# Altium schematic sheet PCB1.SchDoc
size A
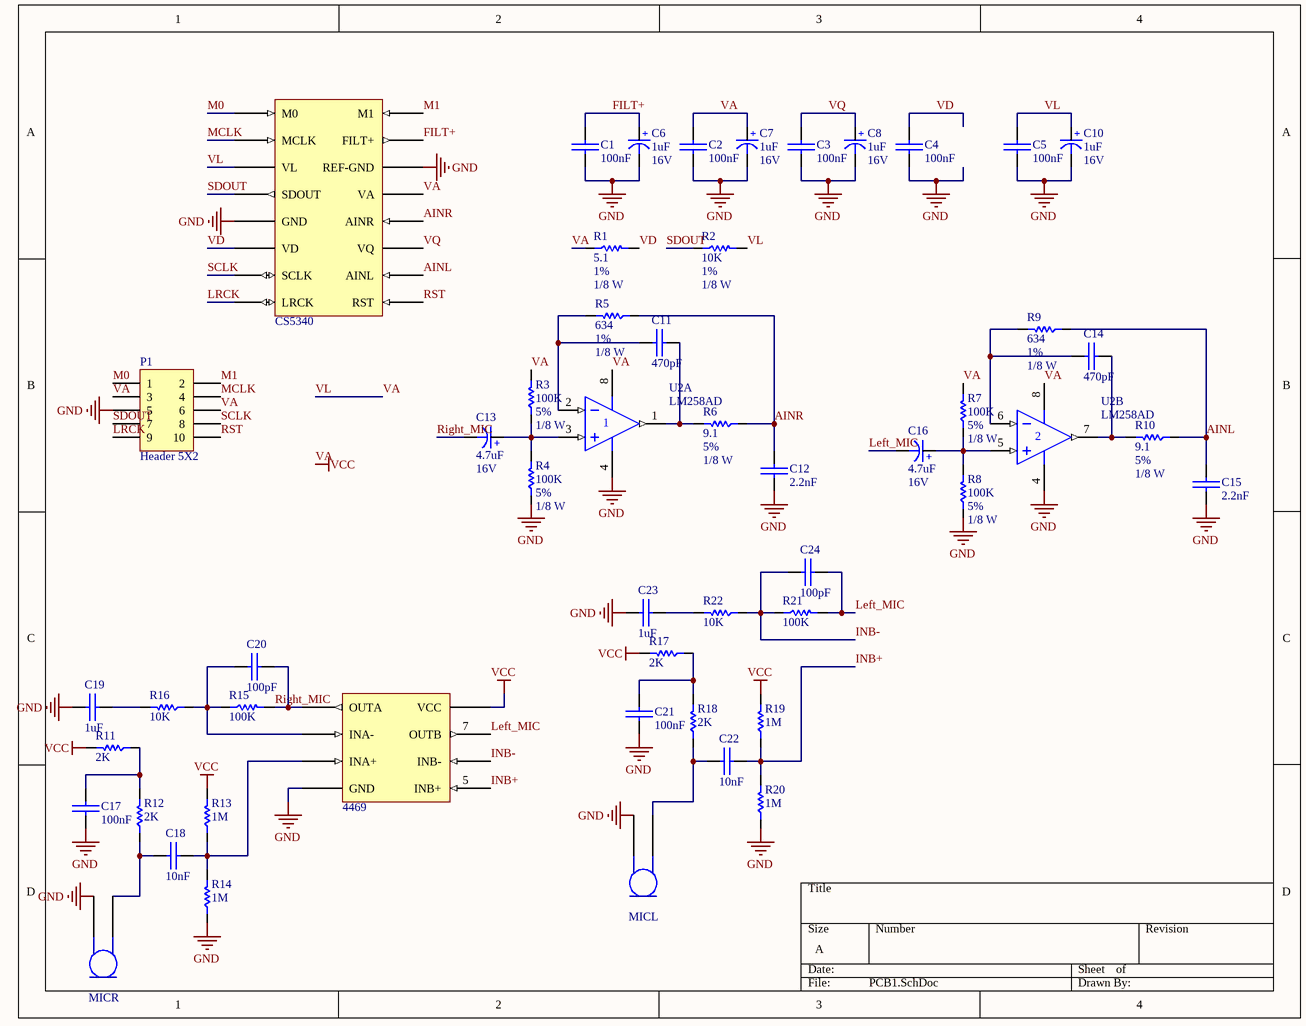
[diagram p0: PCB1.SchDoc]

## Parts
4469  MAX4469EKA+T  [SOT23-8_L]  (value not drawn)
C1  100nF  [SMD_CAP_1206]
C2  100nF  [SMD_CAP_1206]
C3  100nF  [SMD_CAP_1206]
C4  100nF  [SMD_CAP_1206]
C5  100nF  [SMD_CAP_1206]
C6  Voltage: 16V  [CAPP 1206 (3216X18L) Size A]  (hidden comment: 1uF)
C7  Voltage: 16V  [CAPP 1206 (3216X18L) Size A]  (hidden comment: 1uF)
C8  Voltage: 16V  [CAPP 1206 (3216X18L) Size A]  (hidden comment: 1uF)
C10  Voltage: 16V  [CAPP 1206 (3216X18L) Size A]  (hidden comment: 1uF)
C11  470pF  [SMD_CAP_1206]
C12  2.2nF  [SMD_CAP_1206]
C13  Voltage: 16V  [CAPP 1206 (3216X18L) Size A]  (hidden comment: 4.7uF)
C14  470pF  [SMD_CAP_1206]
C15  2.2nF  [SMD_CAP_1206]
C16  Voltage: 16V  [CAPP 1206 (3216X18L) Size A]  (hidden comment: 4.7uF)
C17  100nF  [SMD_CAP_1206]
C18  10nF  [SMD_CAP_1206]
C19  1uF  [SMD_CAP_1206]
C20  100pF  [SMD_CAP_1206]
C21  100nF  [SMD_CAP_1206]
C22  10nF  [SMD_CAP_1206]
C23  1uF  [SMD_CAP_1206]
C24  100pF  [SMD_CAP_1206]
CS5340  CS5340-CZZ  [TSSOP16_L]  (value not drawn)
MICL  Electret Microphone 10mm  [MIC1]  (value not drawn)
MICR  Electret Microphone 10mm  [MIC1]  (value not drawn)
P1  Header 5X2  [FKV10LN]
R1  Tolerance: 1%  Power: 1/8 W  [RES 1206 (3216X08L)]  (hidden comment: 5.1)
R2  Tolerance: 1%  Power: 1/8 W  [RES 1206 (3216X08L)]  (hidden comment: 10K)
R3  Tolerance: 5%  Power: 1/8 W  [RES 1206 (3216X08L)]  (hidden comment: 100K)
R4  Tolerance: 5%  Power: 1/8 W  [RES 1206 (3216X08L)]  (hidden comment: 100K)
R5  Tolerance: 1%  Power: 1/8 W  [RES 1206 (3216X08L)]  (hidden comment: 634)
R6  Tolerance: 5%  Power: 1/8 W  [RES 1206 (3216X08L)]  (hidden comment: 9.1)
R7  Tolerance: 5%  Power: 1/8 W  [RES 1206 (3216X08L)]  (hidden comment: 100K)
R8  Tolerance: 5%  Power: 1/8 W  [RES 1206 (3216X08L)]  (hidden comment: 100K)
R9  Tolerance: 1%  Power: 1/8 W  [RES 1206 (3216X08L)]  (hidden comment: 634)
R10  Tolerance: 5%  Power: 1/8 W  [RES 1206 (3216X08L)]  (hidden comment: 9.1)
R11  2K  [RES 1206 (3216X08L)]
R12  2K  [RES 1206 (3216X08L)]
R13  1M  [RES 1206 (3216X08L)]
R14  1M  [RES 1206 (3216X08L)]
R15  100K  [RES 1206 (3216X08L)]
R16  10K  [RES 1206 (3216X08L)]
R17  2K  [RES 1206 (3216X08L)]
R18  2K  [RES 1206 (3216X08L)]
R19  1M  [RES 1206 (3216X08L)]
R20  1M  [RES 1206 (3216X08L)]
R21  100K  [RES 1206 (3216X08L)]
R22  10K  [RES 1206 (3216X08L)]
U2  LM258AD  [D008_L]  (parts A,B of 2)

## Nets
GND: 4469.4(GND) C1.2(-) C2.2(-) C3.2(-) C4.2(-) C5.2(-) C6.2(-) C7.2(-) C8.2(-) C10.2(-) C12.2(-) C15.2(-) C17.1(+) C19.1(+) C21.1(+) C23.1(+) CS5340.5(GND) CS5340.14(REF-GND) MICL.2 MICR.2 P1.5 R4.1 R8.1 R14.1 R20.1 U2.4(V-)
VA: 4469.8(VCC) C2.1(+) C5.1(+) C7.1(+) C10.1(+) CS5340.3(VL) CS5340.13(VA) P1.3 P1.6 R1.1 R2.2 R3.2 R7.2 R11.2 R13.2 R17.2 R19.2 U2.8(V+)  [also labelled VCC, VL]
AINL: C15.1(+) CS5340.10(AINL) R9.1 R10.1
AINR: C12.1(+) CS5340.12(AINR) R5.1 R6.1
FILT+: C1.1(+) C6.1(+) CS5340.15(FILT+)
INB+: 4469.5(INB+) C22.2(-) R19.1 R20.2
INB-: 4469.6(INB-) C24.1(+) R21.1 R22.1
Left_MIC: 4469.7(OUTB) C16.2(-) C24.2(-) R21.2
LRCK: CS5340.8(LRCK) P1.9
M0: CS5340.1(M0) P1.1
M1: CS5340.16(M1) P1.2
MCLK: CS5340.2(MCLK) P1.4
Right_MIC: 4469.1(OUTA) C13.2(-) C20.2(-) R15.2
RST: CS5340.9(RST) P1.10
SCLK: CS5340.7(SCLK) P1.8
SDOUT: CS5340.4(SDOUT) P1.7 R2.1
VD: C4.1(+) CS5340.6(VD) R1.2
VQ: C3.1(+) C8.1(+) CS5340.11(VQ)
Net4469_2: 4469.2(INA-) C20.1(+) R15.1 R16.1
Net4469_3: 4469.3(INA+) C18.2(-) R13.1 R14.2
NetC11_1: C11.1(+) R5.2 U2.2(IN-)
NetC11_2: C11.2(-) R6.2 U2.1(OUT)
NetC13_1: C13.1(+) R3.1 R4.2 U2.3(IN+)
NetC14_1: C14.1(+) R9.2 U2.6(IN-)
NetC14_2: C14.2(-) R10.2 U2.7(OUT)
NetC16_1: C16.1(+) R7.1 R8.2 U2.5(IN+)
NetC17_2: C17.2(-) R11.1 R12.2
NetC18_1: C18.1(+) MICR.1 R12.1
NetC19_2: C19.2(-) R16.2
NetC21_2: C21.2(-) R17.1 R18.2
NetC22_1: C22.1(+) MICL.1 R18.1
NetC23_2: C23.2(-) R22.2

## Library data of the parts
4469 = MAX4469EKA+T: Low-Cost, Micropower, SC70/SOT23-8, Microphone Preamplifier
C1-C5 C11 C12 C14 C15 C17-C24 = Cap-Bipolar: Bipolar Capacitor; Voltage: 100V; Designer: Saeid Jorablo; Organazation: ControTec; Adding Date: 1387/12/20
  C1-C5 C17 C21: Value: 100nF
  C11 C14: Value: 470pF
  C12 C15: Value: 2.2nF
  C18 C22: Value: 10nF
  C19 C23: Value: 1uF
  C20 C24: Value: 100pF
C6-C8 C10 C13 C16 = Cap-Polar: Polar Capacitor; Designer: Saeid Jorablo; Organazation: ControTec; Adding Date: 1387/12/20
  C6-C8 C10: Value: 1uF
  C13 C16: Value: 4.7uF
CS5340 = CS5340-CZZ: ADC, Audio 24 bit 192k Serial 16-TSSOP
MICL MICR = Microphone
P1 = Header 5X2: Header, 5-Pin, Dual row; LatestRevisionDate: 17-Jul-2002; LatestRevisionNote: Re-released for DXP Platform.; Publisher: Altium Limited
R1-R10 = Resistor
  R1: Value: 5.1
  R2: Value: 10K
  R3 R4 R7 R8: Value: 100K
  R5 R9: Value: 634
  R6 R10: Value: 9.1
R11-R22 = Resistor: Tolerance: 5%; Power: 1/8 W
  R11 R12 R17 R18: Value: 2K
  R13 R14 R19 R20: Value: 1M
  R15 R21: Value: 100K
  R16 R22: Value: 10K
U2 = LM258AD: Dual Operational Amplifier; Published: 15-Apr-2002; LatestRevisionDate: 13-Apr-2006; LatestRevisionNote: IPC-7351 Footprint Added.; DatasheetVersion: Aug-1988; PackageVersion: Jan-1998; PackageReference: D008; Publisher: Altium Limited; PackageDescription: 8-Pin Small Outline Integrated Circuit 1.27 mm Pitch; Code_IPC: SOIC127P600-8; ComponentLink1Description: Manufacturer Link; ComponentLink1URL: http://www.ti.com/; ComponentLink2Description: Datasheet; ComponentLink2URL: http://www-s.ti.com/sc/ds/lm258.pdf